# EAGLE design holo_control (EAGLE 7.5.0)
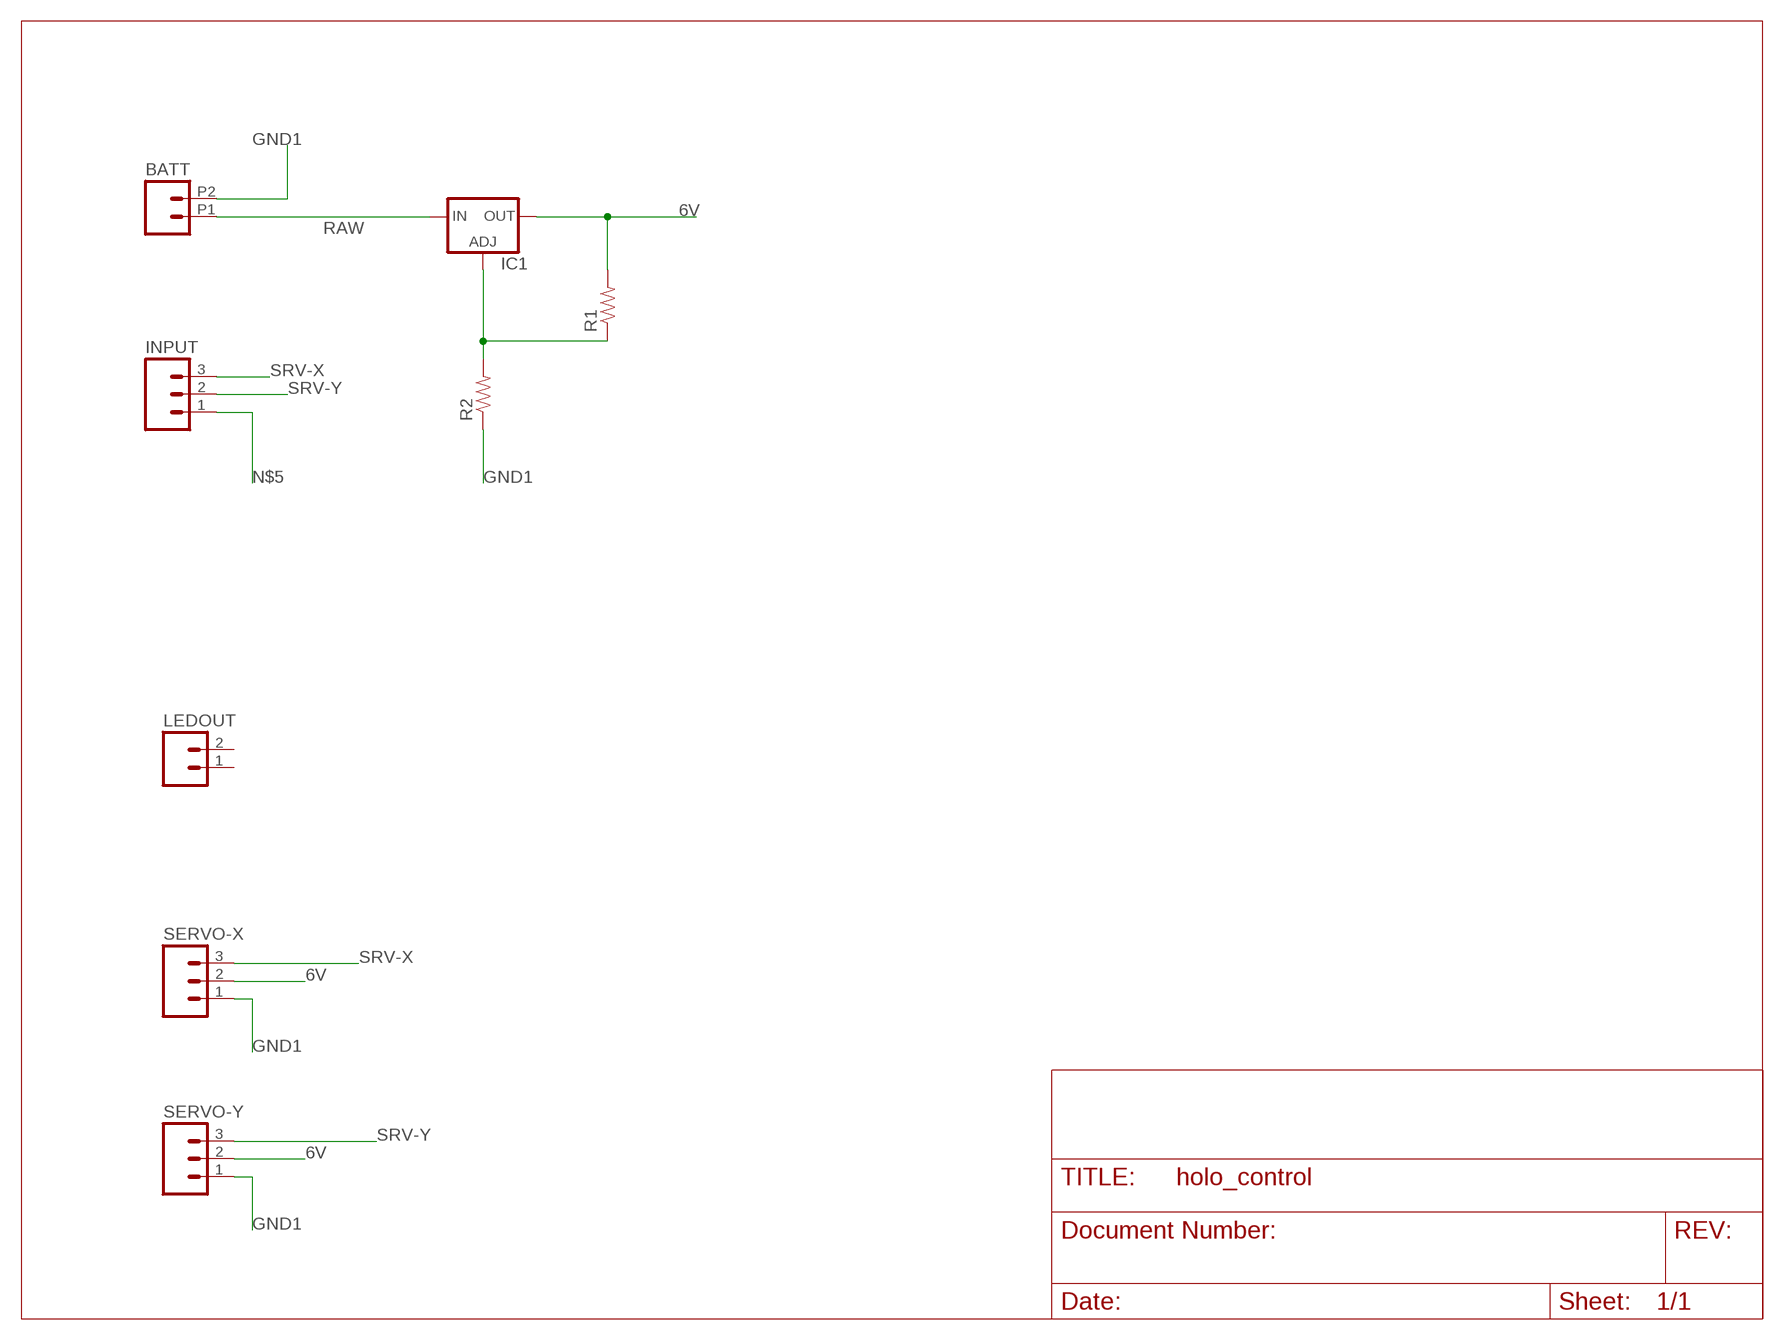
[diagram p0: schematic, sheet 1]

## Parts
BATT  M022.54MM_SCREWTERM  [1X02_2.54_SCREWTERM]
IC1  LM317TS  [317TS]
INPUT  M03PTH  [1X03]
LEDOUT  M02PTH  [1X02]
R1  RESISTORPTH-1/4W  [AXIAL-0.4]
R2  RESISTORPTH-1/4W  [AXIAL-0.4]
SERVO-X  M03PTH  [1X03]
SERVO-Y  M03PTH  [1X03]

## Nets
6V: IC1.2(OUT) R1.P$2 SERVO-X.2 SERVO-Y.2
GND1: BATT.P2 R2.P$1 SERVO-X.1 SERVO-Y.1
N$1: IC1.1(ADJ) R1.P$1 R2.P$2
N$5: INPUT.1
RAW: BATT.P1 IC1.3(IN)
SRV-X: INPUT.3 SERVO-X.3
SRV-Y: INPUT.2 SERVO-Y.3
Unconnected: LEDOUT.1 LEDOUT.2

## Library data of the parts
BATT LEDOUT = SparkFun-Connectors:M02: Standard 2-pin 0.1" header. Use with - straight break away headers ( PRT-00116) - right angle break away headers (PRT-00553) - swiss pins (PRT-00743) - machine pins (PRT-00117) - female headers (PRT-00115) Molex polarized connector foot print use with: PRT-08233 with associated crimp pins and housings. 2.54_SCREWTERM for use with PRT-10571. 3.5mm Screw Terminal footprints for PRT-08084 5mm Screw Terminal footprints for use with PRT-08432
IC1 = v-reg:LM317TS: VOLTAGE REGULATOR
INPUT SERVO-X SERVO-Y = SparkFun-Connectors:M03: Header 3 Standard 3-pin 0.1" header. Use with straight break away headers (SKU : PRT-00116), right angle break away headers (PRT-00553), swiss pins (PRT-00743), machine pins (PRT-00117), and female headers (PRT-00115). Molex polarized connector foot print use with SKU : PRT-08232 with associated crimp pins and housings.
R1 R2 = SparkFun-Resistors:RESISTOR: Resistor Basic schematic elements and footprints for 0603, 1206, and PTH resistors.

## Board
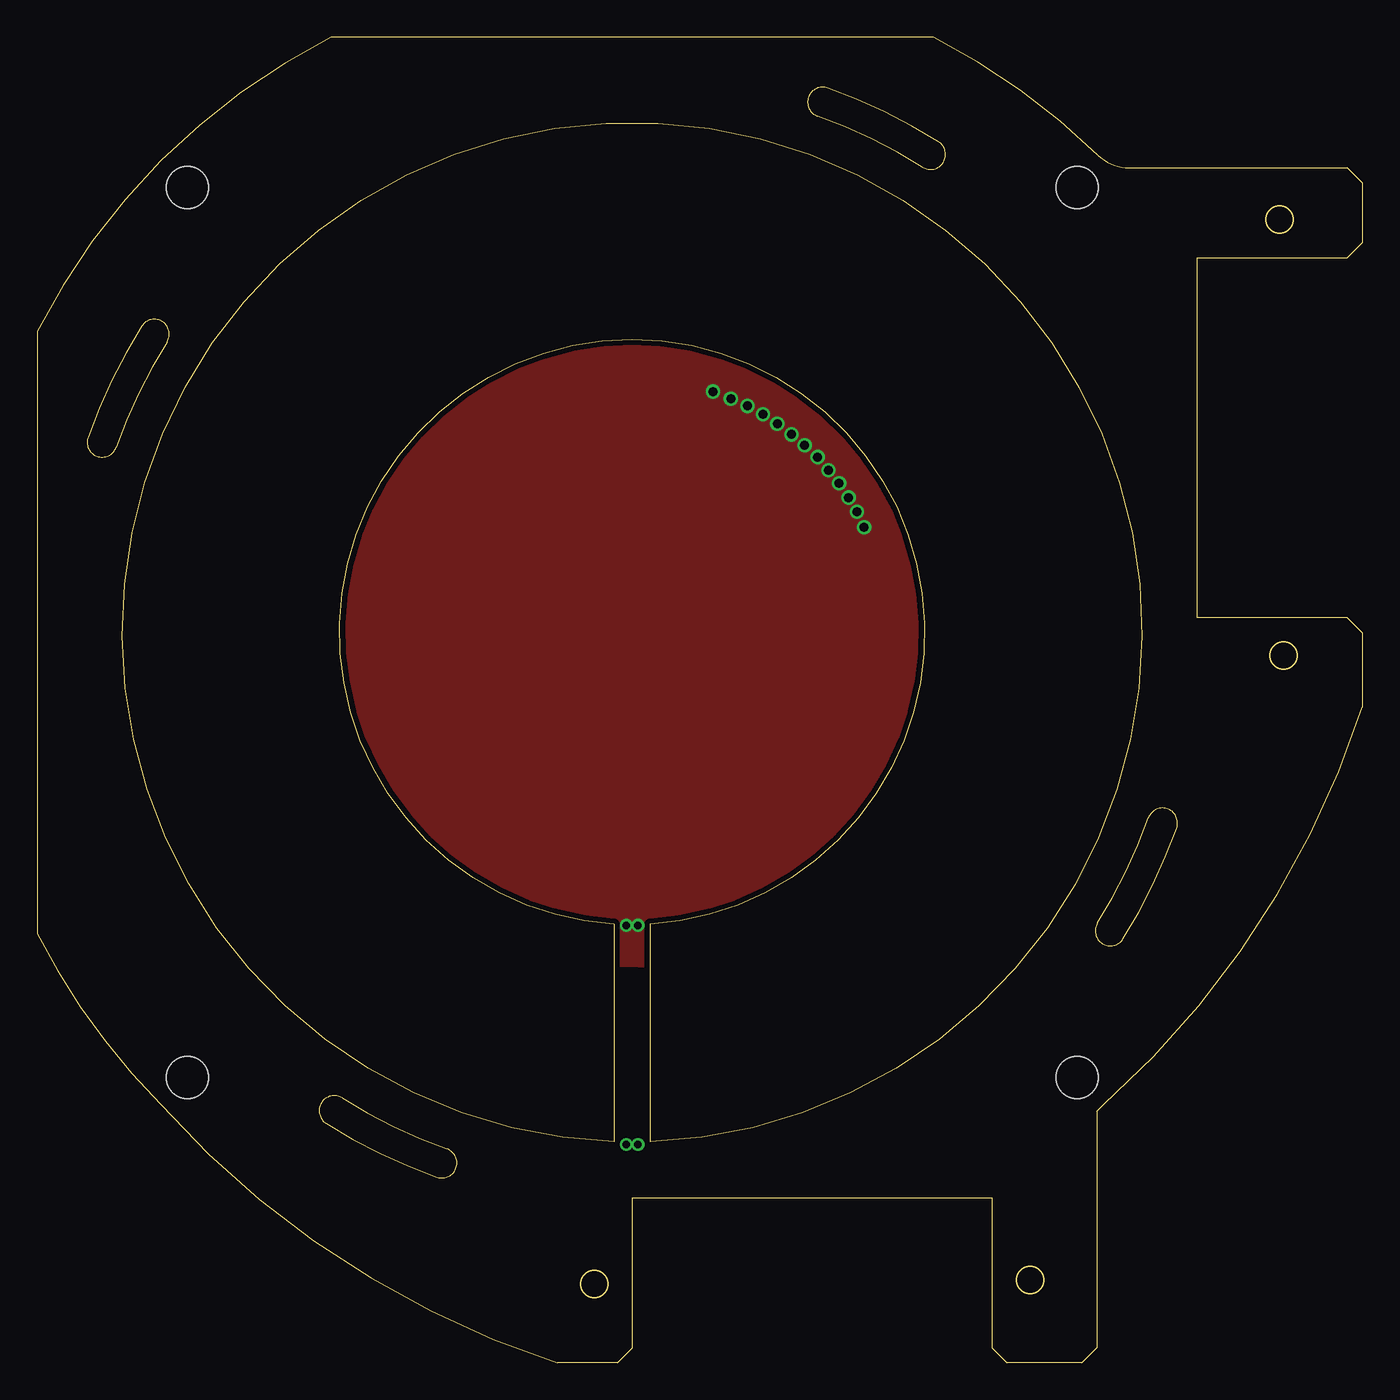
[diagram p1: board, top side]
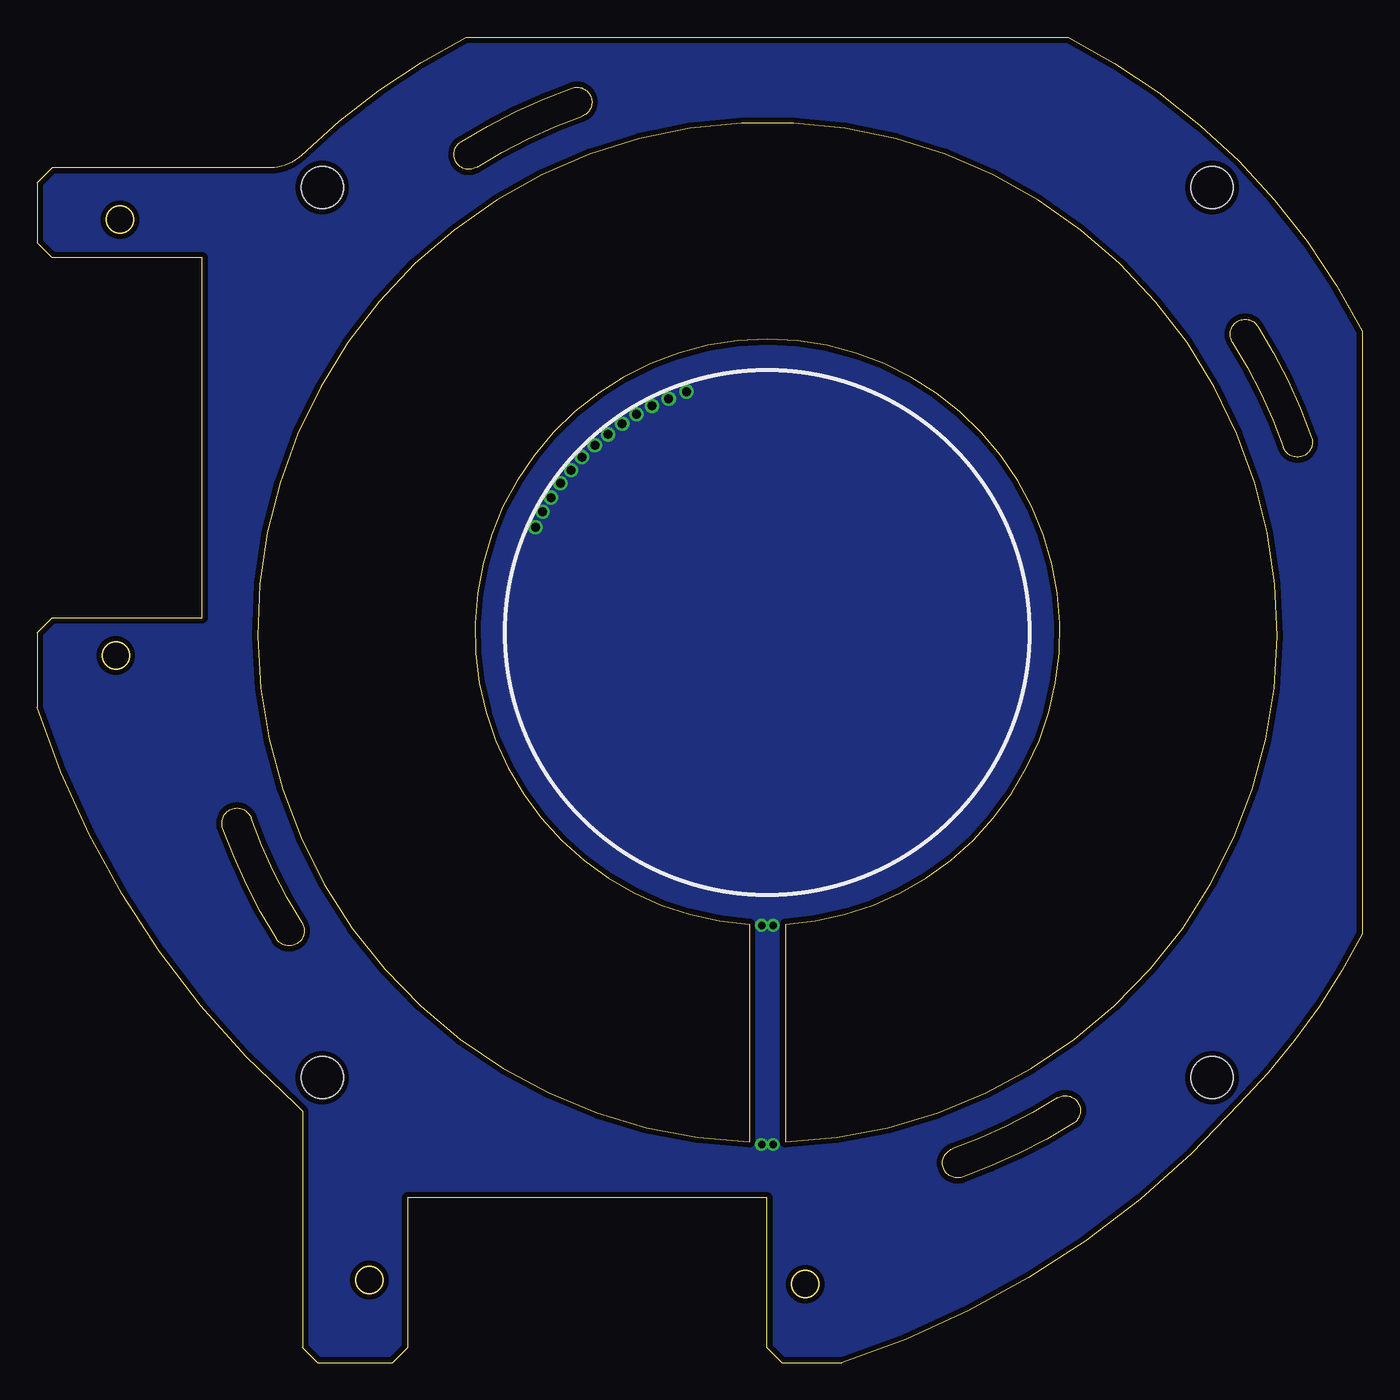
[diagram p2: board, bottom side, seen from below]

Size 88.4 x 88.4 mm. Coordinates in mm from the lower left corner, seen from the top.
Outline: 38.48,14.72 38.48,29.24 arc-353 40.89,29.24 40.89,14.72
Outline: 38.48,14.72 38.49,14.72
Outline: 40.89,14.72 40.89,14.72
Outline: 38.48,14.72 arc-356 40.89,14.72
Outline: 59.07,79.75 arc180 60.13,81.44 arc12 52.74,85.03 arc180 52.06,83.14 arc-12 59.07,79.75
Outline: 8.65,68.07 arc180 6.95,69.13 arc12 3.37,61.74 arc180 5.25,61.06 arc-12 8.65,68.07
Outline: 20.33,17.65 arc180 19.27,15.95 arc12 26.66,12.37 arc180 27.34,14.25 arc-12 20.33,17.65
Outline: 70.75,29.33 arc180 72.45,28.27 arc12 76.03,35.66 arc180 74.14,36.34 arc-12 70.75,29.33
Outline: 69.7,0 64.7,0 63.7,1 63.7,11 39.7,11 39.7,1 38.7,0 34.7,0 arc-30 8.23,17.23 arc-18 0,28.59 0,68.81 arc-36 19.59,88.4 59.81,88.4 arc-17 70.77,80.55 arc44 72.87,79.7 87.4,79.7 88.4,78.7 88.4,74.7 87.4,73.7 77.4,73.7 77.4,49.7 87.4,49.7 88.4,48.7 88.4,43.7 arc-30 71.17,17.23 arc-1 70.7,16.77 70.7,1 69.7,0
Outline: circle at 37.16,5.22 radius 0.9
Outline: circle at 66.24,5.5 radius 0.9
Outline: circle at 83.17,47.16 radius 0.9
Outline: circle at 82.9,76.24 radius 0.9
Copper layers (1*16): Top 0.0356mm / dielectric 1.5011mm / Bottom 0.0356mm
Design rules "oshpark-2layer": minimum track width 6mil, minimum drill 13mil, track to track 6mil, track to pad 6mil, pad to pad 6mil, via to via 6mil, smd to smd 6mil, copper to edge 15mil, drill to drill 6mil, minimum pad ring 7mil, minimum via ring 7mil, stop-mask expansion 4mil, vias tented up to drill 0mil, thermal gap 10mil
Holes 2.8 mm at 10,78.4 69.4,78.4 10,19 69.4,19

### Footprints (pad centres in the part's own frame; a part is rotated, then mirrored left to right if it is on the bottom)
1X02_2.54_SCREWTERM = drill 1.016 square: P1 2.54,0; P2 0,0
317TS = drill 1.016 long: 1 -2.54,-2.54; 2 0,-2.54; 3 2.54,-2.54
1X03 = drill 1.016 pad 1.88: 1 0,0; 2 2.54,0; 3 5.08,0
1X02 = drill 1.016 pad 1.88: 1 0,0; 2 2.54,0
AXIAL-0.4 = drill 0.9 pad 1.88: P$1 -5.08,0; P$2 5.08,0

### Placement (x,y rotation side)
BATT  -14.41,1.98 0 top  (outside the outline)
IC1  -10.4,-1.43 0 top  (outside the outline)
INPUT  -14.13,-24.53 0 top  (outside the outline)
LEDOUT  -14.13,-39.29 0 top  (outside the outline)
R1  -9.88,-11.03 0 top  (outside the outline)
R2  -9.88,-15.36 0 top  (outside the outline)
SERVO-X  -14.13,-29.45 0 top  (outside the outline)
SERVO-Y  -14.13,-34.37 0 top  (outside the outline)

### Tracks (layer width: path | path; a pad name or v marks a point on that pad's centre or on a via)
6V  (3 unrouted)
GND  (via drill 0.5, 0.6)
  other vias: 45.09,64.77 46.28,64.29 47.39,63.82 48.42,63.26 49.37,62.63 50.32,61.91 51.2,61.2 52.07,60.4 52.78,59.53 53.5,58.66 54.13,57.71 54.69,56.75 55.17,55.72 39.3,29.17 40.08,29.17 39.3,14.55 40.08,14.55
  pour Bottom: -10.16,90.17 -10.16,-1.27 96.52,-1.27 96.52,90.17
  pour Top: 19.05,71.12 19.05,26.67 61.08,26.35 61.08,70.8
GND1  (3 unrouted)
N$1  (2 unrouted)
RAW  (1 unrouted)
SRV-X  (1 unrouted)
SRV-Y  (1 unrouted)

### Text on the board
Document: CORRECT SIZE | INTER HOLE = 28.14mm